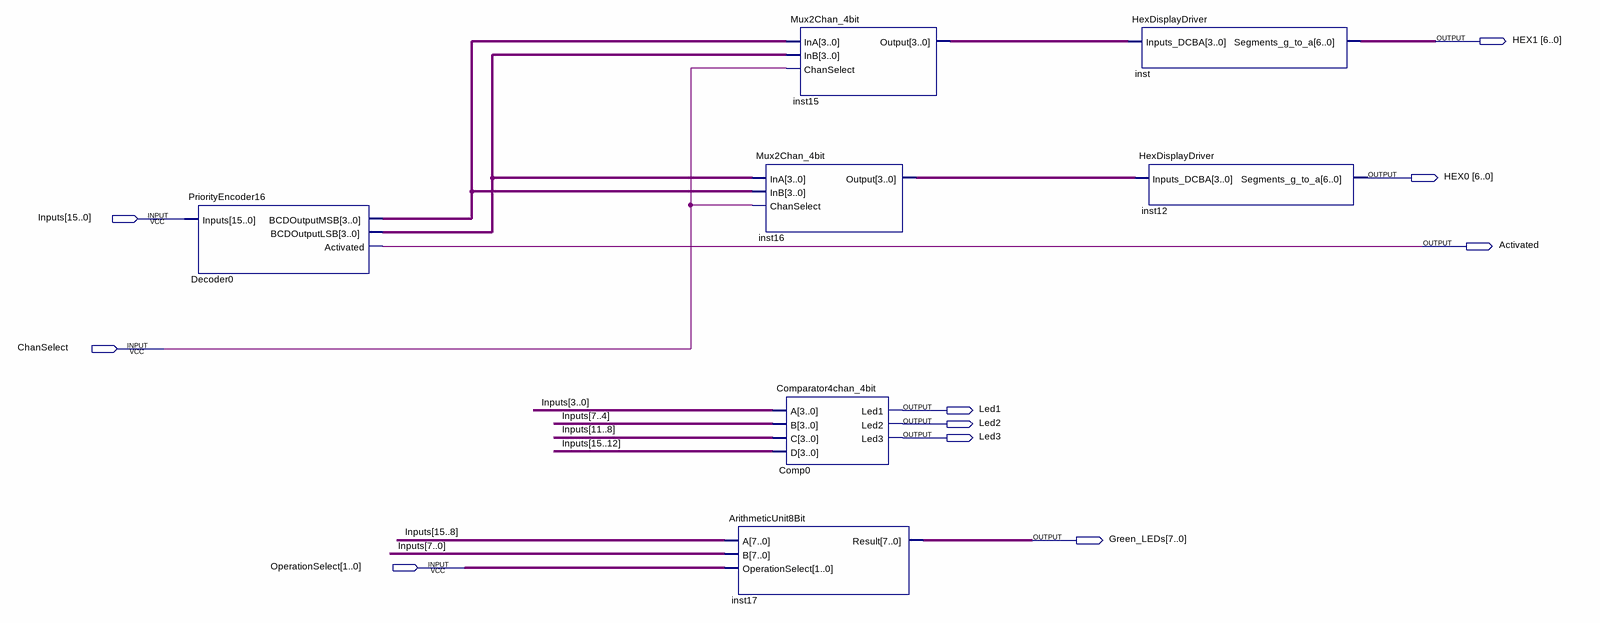
[diagram p0: schematic sheet]
// Quartus schematic HEXto7SegDecoder.bdf as structural Verilog: 7 symbols, 10 pins
module HEXto7SegDecoder (
  input  [15:0] Inputs,
  input  ChanSelect,
  input  [1:0] OperationSelect,
  output [6:0] HEX1,
  output [6:0] HEX0,
  output Activated,
  output Led1,
  output Led2,
  output Led3,
  output [7:0] Green_LEDs
);

  wire [3:0] Decoder0_bcdoutputlsb, Decoder0_bcdoutputmsb, inst15_output, inst16_output;

  PriorityEncoder16 Decoder0 (
    .Inputs(Inputs), .BCDOutputMSB(Decoder0_bcdoutputmsb), .BCDOutputLSB(Decoder0_bcdoutputlsb),
    .Activated(Activated));
  Mux2Chan_4bit inst16 (
    .InA(Decoder0_bcdoutputlsb), .InB(Decoder0_bcdoutputmsb), .ChanSelect(ChanSelect), .Output(inst16_output));
  ArithmeticUnit8Bit inst17 (.A(Inputs[15:8]), .B(Inputs[7:0]), .OperationSelect(OperationSelect), .Result(Green_LEDs));
  Mux2Chan_4bit inst15 (
    .InA(Decoder0_bcdoutputmsb), .InB(Decoder0_bcdoutputlsb), .ChanSelect(ChanSelect), .Output(inst15_output));
  Comparator4chan_4bit Comp0 (
    .A(Inputs[3:0]), .B(Inputs[7:4]), .C(Inputs[11:8]), .D(Inputs[15:12]), .Led1(Led1), .Led2(Led2),
    .Led3(Led3));
  HexDisplayDriver inst (.Inputs_DCBA(inst15_output), .Segments_g_to_a(HEX1));
  HexDisplayDriver inst12 (.Inputs_DCBA(inst16_output), .Segments_g_to_a(HEX0));
endmodule
